# Altium schematic sheet LVDS_Receiver_Data.SchDoc
size A4; DocumentNumber: 5; SheetNumber: 5; SheetTotal: 11
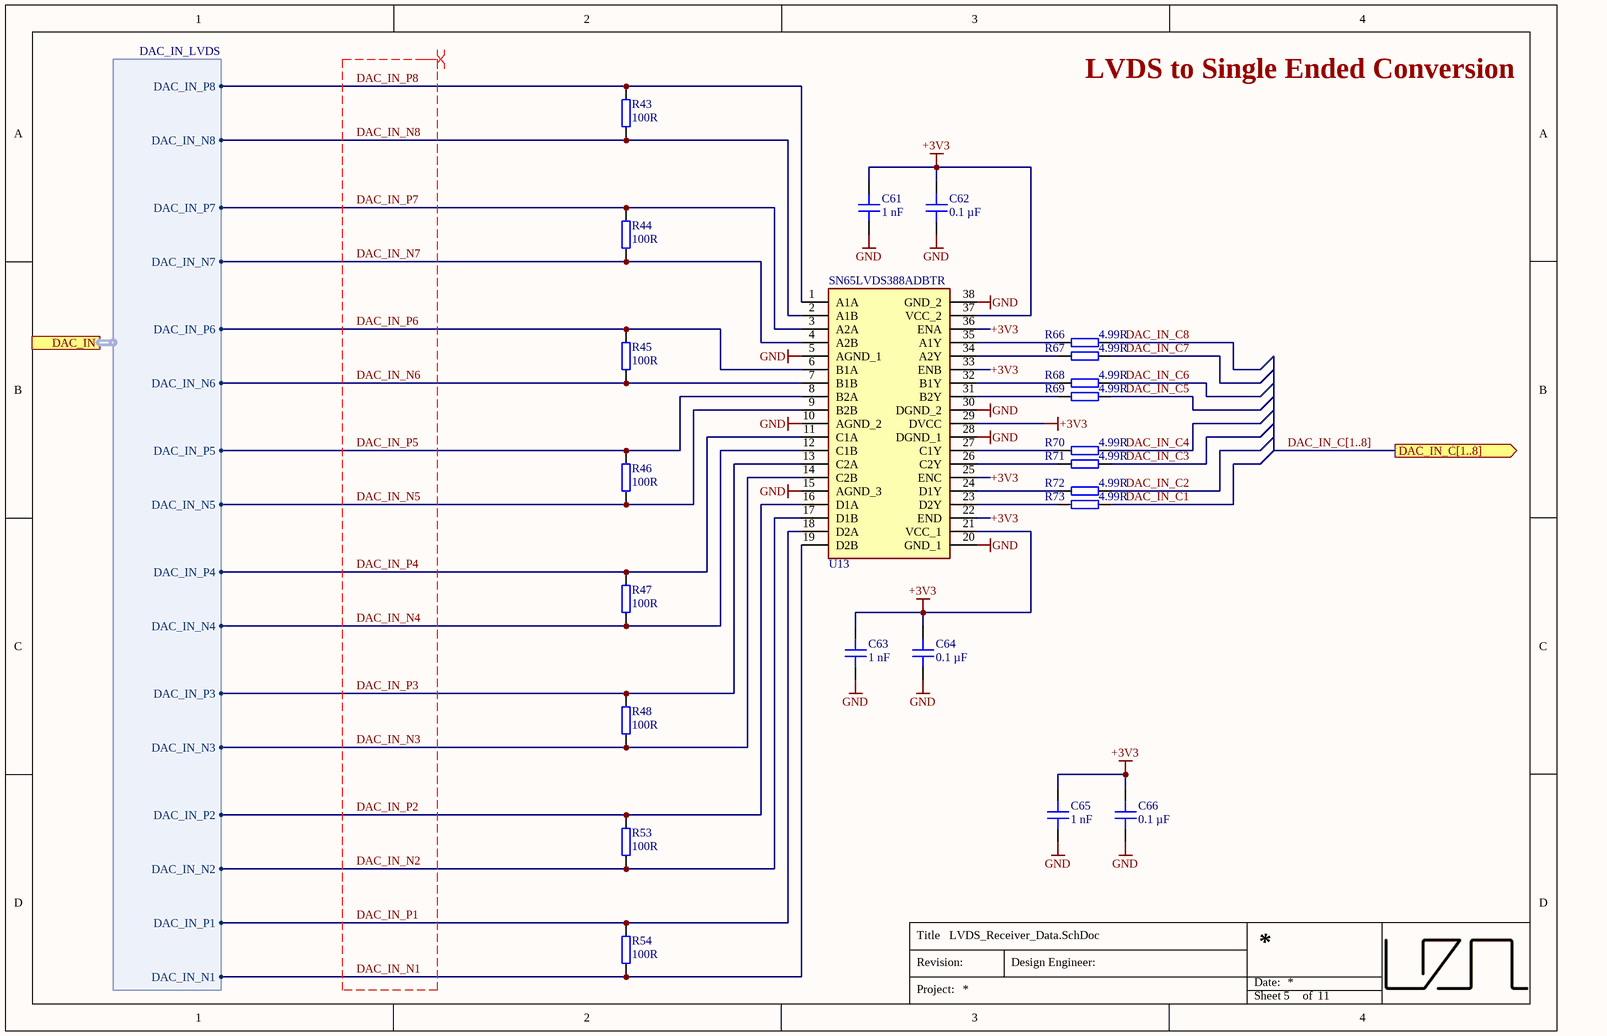
[diagram p0: LVDS_Receiver_Data.SchDoc]

## Parts
C61  1 nF  [C_1206]
C62  0.1 µF  [C_0603]
C63  1 nF  [C_1206]
C64  0.1 µF  [C_0603]
C65  1 nF  [C_1206]
C66  0.1 µF  [C_0603]
R43  100R  [RES 0603_1608]
R44  100R  [RES 0603_1608]
R45  100R  [RES 0603_1608]
R46  100R  [RES 0603_1608]
R47  100R  [RES 0603_1608]
R48  100R  [RES 0603_1608]
R53  100R  [RES 0603_1608]
R54  100R  [RES 0603_1608]
R66  4.99R  [RES 0603_1608]
R67  4.99R  [RES 0603_1608]
R68  4.99R  [RES 0603_1608]
R69  4.99R  [RES 0603_1608]
R70  4.99R  [RES 0603_1608]
R71  4.99R  [RES 0603_1608]
R72  4.99R  [RES 0603_1608]
R73  4.99R  [RES 0603_1608]
U13  SN65LVDS388ADBTR  [SOP50P640X120-38N]

## Ports
DAC_IN (harness DAC_IN_LVDS), DAC_IN_C[1..8] (out)

## Harnesses
DAC_IN_LVDS: DAC_IN_P2, DAC_IN_N2, DAC_IN_P3, DAC_IN_N3, DAC_IN_P4, DAC_IN_N4, DAC_IN_P5, DAC_IN_N5, DAC_IN_P6, DAC_IN_N6, DAC_IN_P7, DAC_IN_N7, DAC_IN_N1, DAC_IN_N8, DAC_IN_P8, DAC_IN_P1

## Nets
+3V3: C61.2 C62.1 C63.2 C64.1 C65.2 C66.1 U13.21(VCC_1) U13.22(END) U13.25(ENC) U13.29(DVCC) U13.33(ENB) U13.36(ENA) U13.37(VCC_2)
GND: C61.1 C62.2 C63.1 C64.2 C65.1 C66.2 U13.5(AGND_1) U13.10(AGND_2) U13.15(AGND_3) U13.20(GND_1) U13.28(DGND_1) U13.30(DGND_2) U13.38(GND_2)
DAC_IN_C1: R73.2
DAC_IN_C2: R72.2
DAC_IN_C3: R71.2
DAC_IN_C4: R70.2
DAC_IN_C5: R69.2
DAC_IN_C6: R68.2
DAC_IN_C7: R67.2
DAC_IN_C8: R66.2
DAC_IN_N1: R54.1 U13.19(D2B) ; port DAC_IN.DAC_IN_N1
DAC_IN_N2: R53.1 U13.17(D1B) ; port DAC_IN.DAC_IN_N2
DAC_IN_N3: R48.1 U13.14(C2B) ; port DAC_IN.DAC_IN_N3
DAC_IN_N4: R47.1 U13.12(C1B) ; port DAC_IN.DAC_IN_N4
DAC_IN_N5: R46.1 U13.9(B2B) ; port DAC_IN.DAC_IN_N5
DAC_IN_N6: R45.1 U13.7(B1B) ; port DAC_IN.DAC_IN_N6
DAC_IN_N7: R44.1 U13.4(A2B) ; port DAC_IN.DAC_IN_N7
DAC_IN_N8: R43.1 U13.2(A1B) ; port DAC_IN.DAC_IN_N8
DAC_IN_P1: R54.2 U13.18(D2A) ; port DAC_IN.DAC_IN_P1
DAC_IN_P2: R53.2 U13.16(D1A) ; port DAC_IN.DAC_IN_P2
DAC_IN_P3: R48.2 U13.13(C2A) ; port DAC_IN.DAC_IN_P3
DAC_IN_P4: R47.2 U13.11(C1A) ; port DAC_IN.DAC_IN_P4
DAC_IN_P5: R46.2 U13.8(B2A) ; port DAC_IN.DAC_IN_P5
DAC_IN_P6: R45.2 U13.6(B1A) ; port DAC_IN.DAC_IN_P6
DAC_IN_P7: R44.2 U13.3(A2A) ; port DAC_IN.DAC_IN_P7
DAC_IN_P8: R43.2 U13.1(A1A) ; port DAC_IN.DAC_IN_P8
NetR66_1: R66.1 U13.35(A1Y)
NetR67_1: R67.1 U13.34(A2Y)
NetR68_1: R68.1 U13.32(B1Y)
NetR69_1: R69.1 U13.31(B2Y)
NetR70_1: R70.1 U13.27(C1Y)
NetR71_1: R71.1 U13.26(C2Y)
NetR72_1: R72.1 U13.24(D1Y)
NetR73_1: R73.1 U13.23(D2Y)

## Buses and harness runs
bus DAC_IN_C[1..8] = port DAC_IN_C[1..8]

## Layout directives
differential pair: DAC_IN_N1, DAC_IN_N2, DAC_IN_N3, DAC_IN_N4, DAC_IN_N5, DAC_IN_N6, DAC_IN_N7, DAC_IN_N8, DAC_IN_P1, DAC_IN_P2, DAC_IN_P3, DAC_IN_P4, DAC_IN_P5, DAC_IN_P6, DAC_IN_P7, DAC_IN_P8

## Notes on the sheet
- LVDS to Single Ended Conversion
- Title
- Revision:
- Design Engineer:
- Date:
- Project:
- Sheet
- of

## Library data of the parts
C61 C63 C65 = 12065C102KAT2A: Capacitor 1206, 50 VDC, 1 nF, X7R; Manufacturer: AVX; Tolerance: 10%; Voltage Rating: 50 VDC; Created from: MGremer; Manufacturer Part Number: 12065C102KAT2A; PartID: 73; Created On: 20.12.2020 13:54:13; ComponentLink1Description: Datasheet; ComponentLink1URL: https://www.mouser.de/datasheet/2/40/X7RDielectric-777024.pdf; Component Type: Capacitor 1206; Device Package: 1206; Last Updated: 18.01.2021 14:28:15; Mounting Type: SMD; Operating Temperature: -55 - 125°C; Series: MLCC X7R; Supplier 1: Mouser; Supplier Part Number 1: 581-12065C102K; Type: Capacitor; Value: 1 nF; Live Cycle Status: 1; Stock number: not stored
C62 C64 C66 = C0603X104K5RAC7411: Capacitor 0603, 50 VDC, 0.1 µF, X7R; Manufacturer: KEMET; Tolerance: 10 %; Voltage Rating: 50 VDC; Created from: MGremer; Manufacturer Part Number: C0603X104K5RAC7411; PartID: 3; Created On: 20.12.2020 13:54:13; ComponentLink1Description: Datasheet; ComponentLink1URL: https://www.mouser.de/datasheet/2/212/1/KEM_C1013_X7R_FT_CAP_SMD-1103280.pdf; Component Type: Capacitor 0603; Device Package: 0603; Last Updated: 04.03.2021 09:24:28; Mounting Type: SMD; Operating Temperature: -55 - 125°C; Series: SMD Comm X7R Flex; Supplier 1: Mouser; Supplier Part Number 1: 80-C0603X104K5R7411; Supplier 2: LCSC; Supplier Part Number 2: C14663; Type: Capacitor; Value: 0.1 µF; Live Cycle Status: 1; LCSC Part Number: C14663; Stock number: Labor SMD Container
R43-R48 R53 R54 = AC0603FR-13100RL: SMD resistor 1%; Manufacturer: Yageo; Created from: MGremer; Manufacturer Part Number: AC0603FR-13100RL; PartID: 161; Created On: 14.12.2020 16:17:14; ComponentLink1Description: Datasheet; ComponentLink1URL: https://www.mouser.de/datasheet/2/447/PYu-AC_51_RoHS_L_7-1714230.pdf; Component Type: SMD resistor; Device Package: 0603; Last Updated: 02.03.2021 14:07:32; Mounting Type: SMD; Supplier 1: Mouser; Supplier Part Number 1: 603-AC0603FR-13100RL; Type: Resistor; Tolerance: 1%; Value: 100R; Live Cycle Status: 1; Stock number: not stored
R66-R73 = CRCW06034R99FKEA: SMD resistor 1%; Manufacturer: Vishay / Dale; Created from: MGremer; Manufacturer Part Number: CRCW06034R99FKEA; PartID: 178; Created On: 14.12.2020 16:17:14; ComponentLink1Description: Datasheet; ComponentLink1URL: https://www.mouser.de/datasheet/2/427/dcrcwe3-1762152.pdf; Component Type: SMD resistor; Device Package: 0603; Last Updated: 02.03.2021 14:07:32; Mounting Type: SMD; Supplier 1: Mouser; Supplier Part Number 1: 71-CRCW0603-4.99-E3; Type: Resistor; Tolerance: 1%; Value: 4.99R; Live Cycle Status: 1; Stock number: not stored
U13 = SN65LVDS388ADBTR: High-Speed Differential Line Receivers; Manufacturer_Name: Texas Instruments; Manufacturer: TI; Created from: MHlatky; Datasheet Link: http://www.ti.com/lit/gpn/SN65LVDS388A; Height: 1.2mm; Manufacturer_Part_Number: SN65LVDS388ADBTR; Manufacturer Part Number: SN65LVDS388ADBTR; PartID: 9; Created On: 03.03.2022 16:53:36; ComponentLink1Description: Datasheet; ComponentLink1URL: https://www.ti.com/lit/ds/symlink/sn65lvds388a.pdf?HQS=dis-mous-null-mousermode-dsf-pf-null-wwe&ts=1646514254859&ref_url=https%253A%252F%252Fwww.mouser.de%252F; Component Type: SN65LVDS388ADBTR; Last Updated: 08.03.2022 12:13:05; Mounting Type: SOP; Operating Temperature: -40 - 85; Supplier 1: Mouser; Supplier Part Number 1: 595-SN65LVDS388ADBTR; Type: LVDS Interface; Live Cycle Status: 1